# EAGLE schematic schemat (EAGLE 7.2.0)
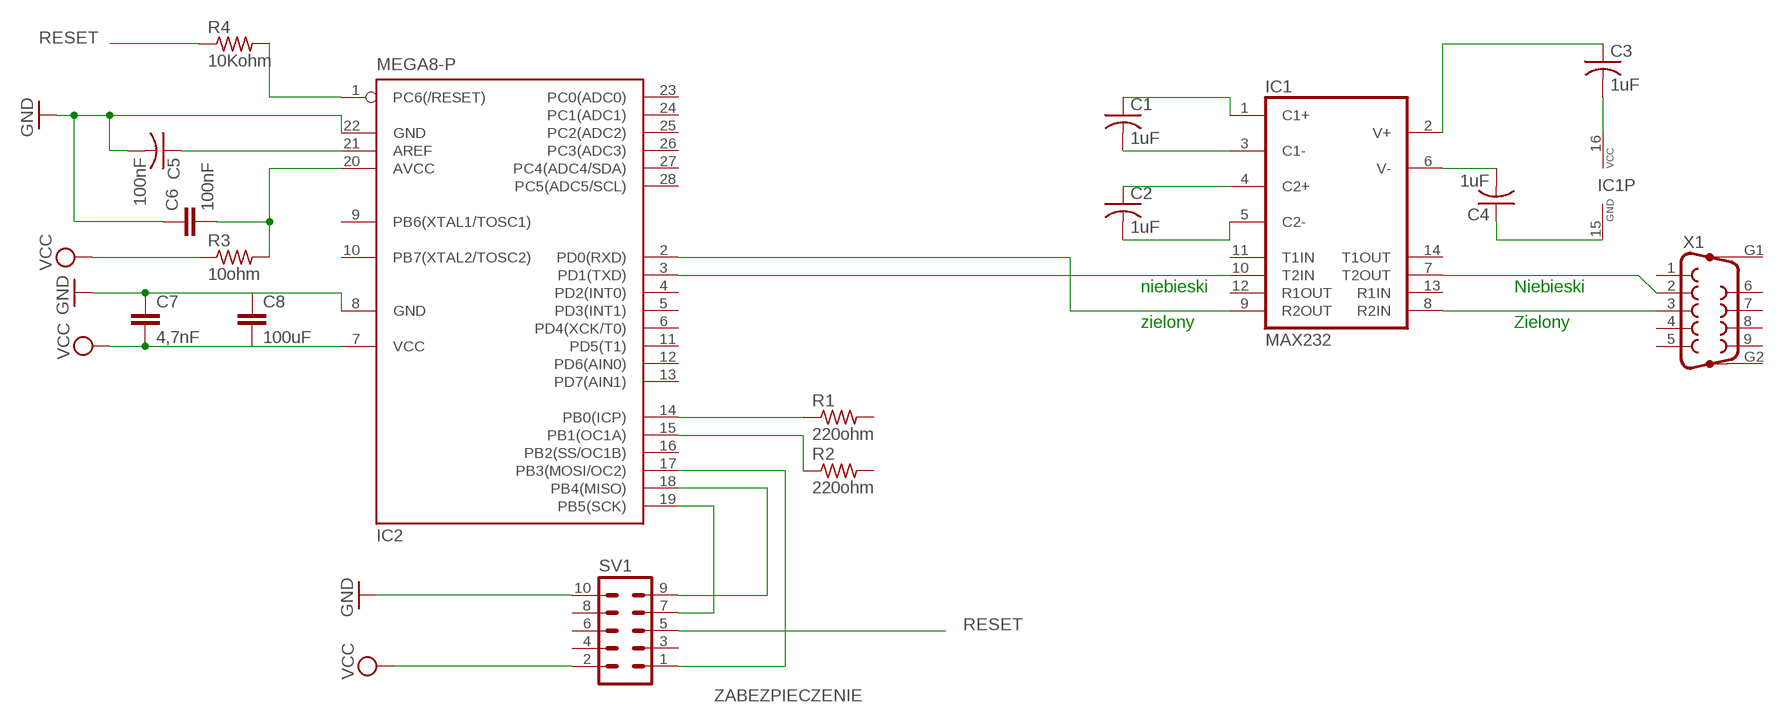
[diagram p0: schematic, sheet 1]

## Parts
C1  1uF  C-US025-024X044  [C025-024X044]
C2  1uF  C-US025-024X044  [C025-024X044]
C3  1uF  C-US025-024X044  [C025-024X044]
C4  1uF  C-US025-024X044  [C025-024X044]
C5  100nF  C-US025-024X044  [C025-024X044]
C6  100nF  C-EU025-024X044  [C025-024X044]
C7  4,7nF  C-EU025-024X044  [C025-024X044]
C8  100uF  C-EU025-024X044  [C025-024X044]
IC1  MAX232  [DIL16]
IC2  MEGA8-P  [DIL28-3]
R1  220ohm  R-US_0207/5V  [0207/5V]
R2  220ohm  R-US_0207/5V  [0207/5V]
R3  10ohm  R-US_0207/5V  [0207/5V]
R4  10Kohm  R-US_0207/5V  [0207/5V]
SV1  ML10  [ML10]
X1  F09HP  [F09HP]

## Nets
GND: C5.2 C6.1 C7.1 C8.1 IC2.8(GND) IC2.22(GND) SV1.10
N$1: C1.1 IC1.1(C1+)
N$2: C1.2 IC1.3(C1-)
N$3: C2.1 IC1.4(C2+)
N$4: C2.2 IC1.5(C2-)
N$5: C3.1 IC1.2(V+)
N$6: C3.2 IC1.16(VCC)
N$7: C4.2 IC1.6(V-)
N$8: C4.1 IC1.15(GND)
N$9: IC1.7(T2OUT) X1.2
N$10: IC1.8(R2IN) X1.3
N$11: IC1.9(R2OUT) IC2.2(PD0(RXD))
N$12: IC1.10(T2IN) IC2.3(PD1(TXD))
N$13: C5.1 IC2.21(AREF)
N$14: IC2.14(PB0(ICP)) R1.1
N$15: IC2.15(PB1(OC1A)) R2.1
N$16: C6.2 IC2.20(AVCC) R3.2
N$17: IC2.1(PC6(/RESET)) R4.2
N$18: IC2.18(PB4(MISO)) SV1.9
N$19: IC2.19(PB5(SCK)) SV1.7
RESET: R4.1 SV1.5
VCC: C7.2 C8.2 IC2.7(VCC) R3.1 SV1.2
ZABEZPIECZENIE: IC2.17(PB3(MOSI/OC2)) SV1.1
Unconnected: IC1.11(T1IN) IC1.12(R1OUT) IC1.13(R1IN) IC1.14(T1OUT) IC2.4(PD2(INT0)) IC2.5(PD3(INT1)) IC2.6(PD4(XCK/T0)) IC2.9(PB6(XTAL1/TOSC1)) IC2.10(PB7(XTAL2/TOSC2)) IC2.11(PD5(T1)) IC2.12(PD6(AIN0)) IC2.13(PD7(AIN1)) IC2.16(PB2(SS/OC1B)) IC2.23(PC0(ADC0)) IC2.24(PC1(ADC1)) IC2.25(PC2(ADC2)) IC2.26(PC3(ADC3)) IC2.27(PC4(ADC4/SDA)) IC2.28(PC5(ADC5/SCL)) R1.2 R2.2 SV1.3 SV1.4 SV1.6 SV1.8 X1.1 X1.4 X1.5 X1.6 X1.7 X1.8 X1.9 X1.G1 X1.G2

## Notes on the sheet
- niebieski | Niebieski
- zielony | Zielony

## Library data of the parts
C1-C5 = rcl:C-US: CAPACITOR, American symbol
C6-C8 = rcl:C-EU: CAPACITOR, European symbol
IC1 = maxim:MAX232: RS232 TRANSCEIVER; MF: MAXIM; MPN: MAX232ACPE+; OC_FARNELL: 9723773; OC_NEWARK: 68K4544
IC2 = atmel:MEGA8-P: MICROCONTROLLER 8 Kbytes FLASH, 1 kbytes SRAM, 512 bytes EEPROM, USART, 4-channel 10 bit ADC, 2-channel 8 bit ADC Pin compatible with Atmega48, ATMega88, ATMega168 Source: avr.lbr; OC_FARNELL: unknown; OC_NEWARK: unknown
R1-R4 = rcl:R-US_: RESISTOR, American symbol
SV1 = con-ml:ML10: HARTING; OC_FARNELL: unknown; OC_NEWARK: unknown
X1 = con-subd:F09HP: SUB-D; OC_FARNELL: unknown; OC_NEWARK: unknown